# Altium schematic sheet POWER.SchDoc
size A4; SheetNumber: 2; SheetTotal: 6
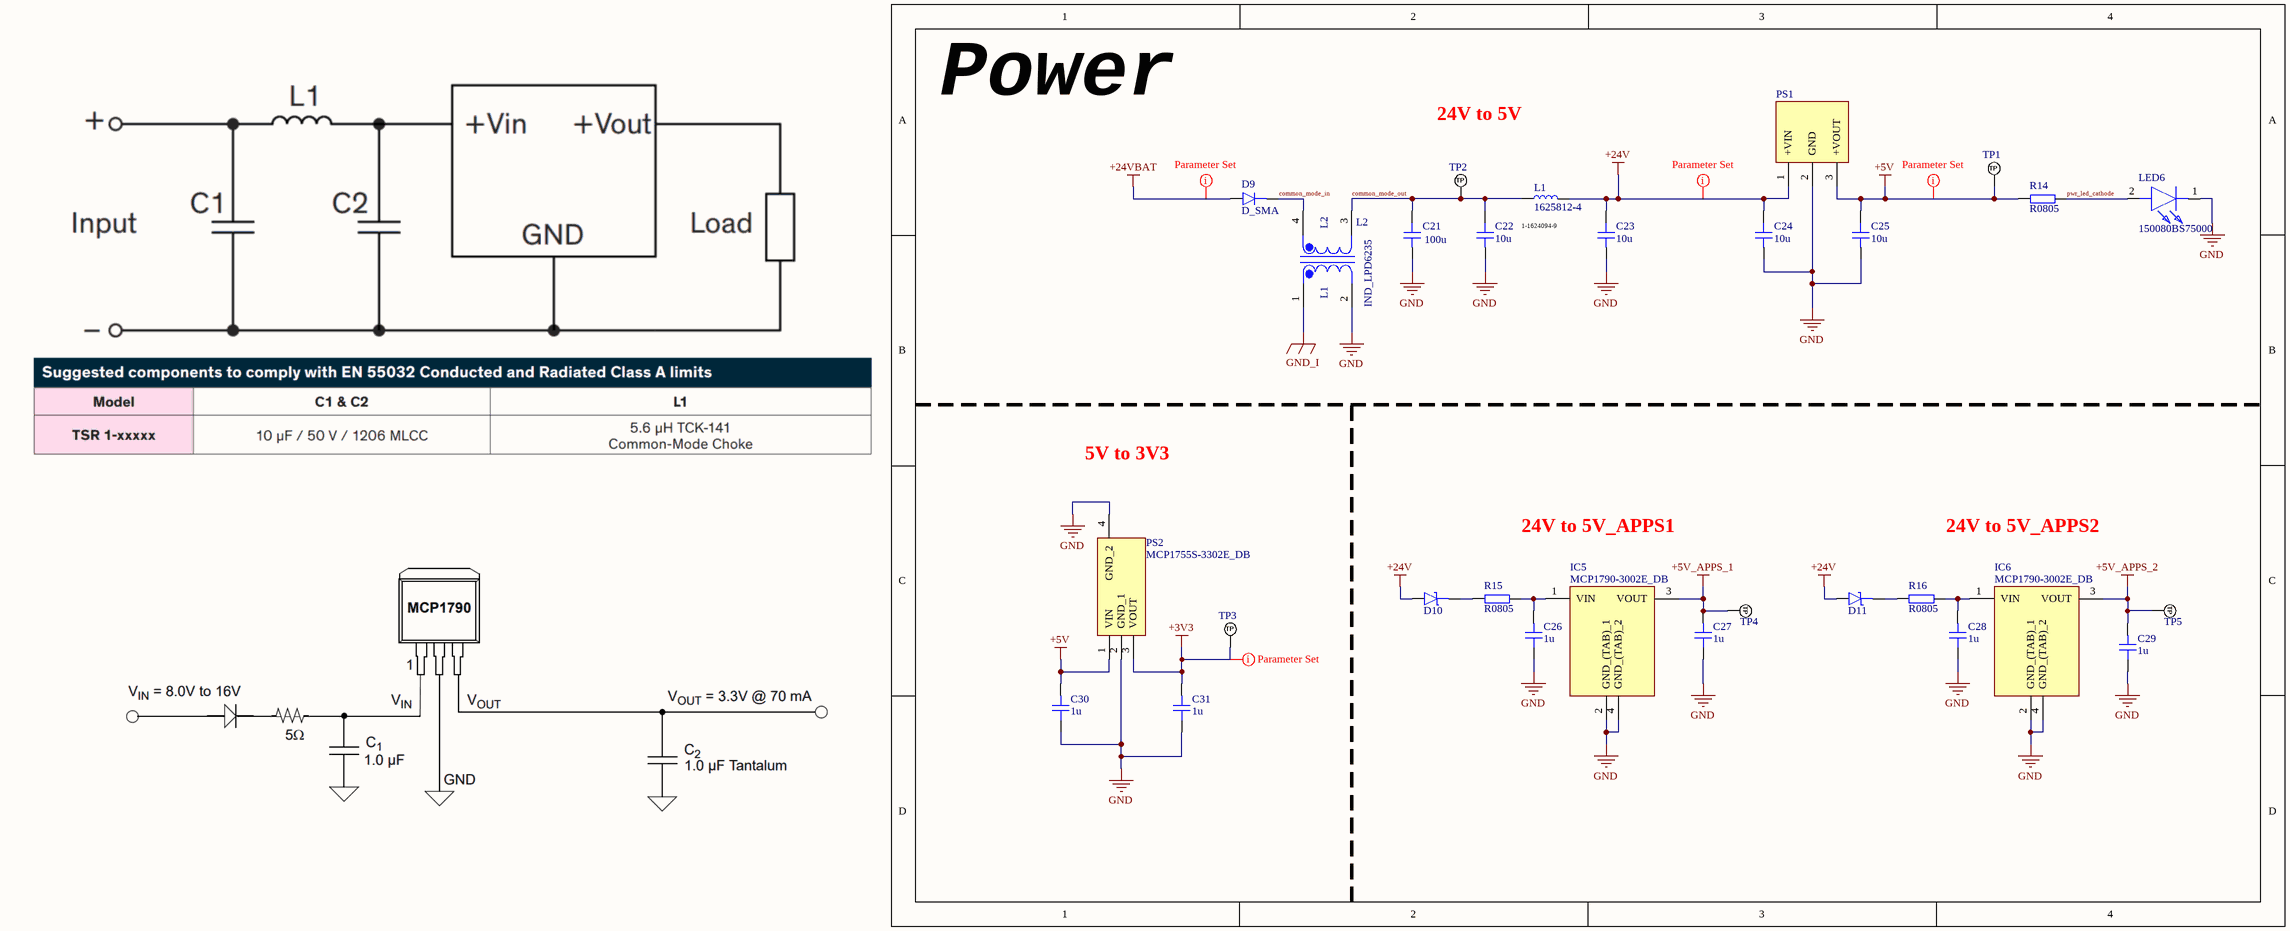
[diagram p0: POWER.SchDoc]

## Parts
C21  100u  [CAP_0805]
C22  10u  [CAP_0805]
C23  10u  [CAP_0805]
C24  10u  [CAP_0805]
C25  10u  [CAP_0805]
C26  1u  [CAP_0805]
C27  1u  [CAP_0805]
C28  1u  [CAP_0805]
C29  1u  [CAP_0805]
C30  1u  [CAP_0805]
C31  1u  [CAP_0805]
D9  D_SMA  [DO-214AC-2 (SMA)]
D10  D_SCHOTTKY_SOD_323  [SOD-323]  (value not drawn)
D11  D_SCHOTTKY_SOD_323  [SOD-323]  (value not drawn)
IC5  MCP1790-3002E_DB  [SOT230P700X180-4N]
IC6  MCP1790-3002E_DB  [SOT230P700X180-4N]
L1  1625812-4  [147873-2 smd button]
L2  IND_LPD6235  [IND_LPD6235]
LED6  150080BS75000  [LEDC2012X80N]
PS1  R-78E5.0-0.5  [R78E5005]  (value not drawn)
PS2  MCP1755S-3302E_DB  [SOT230P700X180-4N]
R14  R0805  [RES_0805]
R15  R0805  [RES_0805]
R16  R0805  [RES_0805]
TP1  TP_NOBOM  [PAD_RND_1MM]  (value not drawn)  (no BOM)
TP2  TP_NOBOM  [PAD_RND_1MM]  (value not drawn)  (no BOM)
TP3  TP_NOBOM  [PAD_RND_1MM]  (value not drawn)  (no BOM)
TP4  TP_NOBOM  [PAD_RND_1MM]  (value not drawn)  (no BOM)
TP5  TP_NOBOM  [PAD_RND_1MM]  (value not drawn)  (no BOM)

## Nets
+3V3: C31.1 PS2.3(VOUT) TP3.1(TP)
+5V: C25.2 C30.1 PS1.3(+VOUT) PS2.1(VIN) R14.1 TP1.1(TP)
+5V_APPS_1: C27.1 IC5.3(VOUT) TP4.1(TP)
+5V_APPS_2: C29.1 IC6.3(VOUT) TP5.1(TP)
+24V: C23.2 C24.2 D10.A D11.A L1.2 PS1.1(+VIN)
+24VBAT: D9.A
GND: C21.1 C22.1 C23.1 C24.1 C25.1 C26.2 C27.2 C28.2 C29.2 C30.2 C31.2 IC5.2(GND_(TAB)_1) IC5.4(GND_(TAB)_2) IC6.2(GND_(TAB)_1) IC6.4(GND_(TAB)_2) L2.2 LED6.1(K) PS1.2(GND) PS2.2(GND_1) PS2.4(GND_2)
GND_I: L2.1
common_mode_in: D9.K L2.4
common_mode_out: C21.2 C22.2 L1.1 L2.3 TP2.1(TP)
pwr_led_cathode: LED6.2(A) R14.2
NetC26_1: C26.1 IC5.1(VIN) R15.1
NetC28_1: C28.1 IC6.1(VIN) R16.1
NetD10_K: D10.K R15.2
NetD11_K: D11.K R16.2

## Layout directives
net class POWER: +3V3, +5V, +24V, +24VBAT

## Notes on the sheet
- Power
- 24V to 5V
- 1-1624094-9
- 5V to 3V3
- 24V to 5V_APPS1
- 24V to 5V_APPS2
- (in symbol IND_LPD6235) L1

## Library data of the parts
C21-C31 = CAP_0805_10V: Capacitor SMD 0805 10V
D9 = D_SMA: Diode SMD SMA (DO-214AA)
D10 D11 = D_SCHOTTKY_SOD_323: Diode Schottky SMD SOD-323
IC5 IC6 = MCP1790-3002E_DB: Integrated Circuit; Manufacturer_Name: Microchip; Manufacturer_Part_Number: MCP1790-3002E/DB; Datasheet Link: http://ww1.microchip.com/downloads/en/DeviceDoc/22075b.pdf; Height: 1.8mm; Mouser Part Number: 579-MCP1790-3002E/DB; Mouser Price/Stock: https://www.mouser.co.uk/ProductDetail/Microchip-Technology/MCP1790-3002E-DB?qs=gsqZ4L1luKroJ%252BBibcYbpw%3D%3D; Arrow Part Number: MCP1790-3002E/DB; Arrow Price/Stock: https://www.arrow.com/en/products/mcp1790-3002edb/microchip-technology?region=nac
L1 = Power_Inductor: TE 1625812-4
LED6 = 150080BS75000: LED; Manufacturer_Name: Wurth Elektronik; Datasheet Link: https://katalog.we-online.com/led/datasheet/150080BS75000.pdf; Height: 0.8mm; Manufacturer_Part_Number: 150080BS75000; Mouser Part Number: 710-150080BS75000; Mouser Price/Stock: https://www.mouser.co.uk/ProductDetail/Wurth-Elektronik/150080BS75000?qs=2kOmHSv6VfT2tBo3UPVqAQ%3D%3D
PS1 = R-78E5.0-0.5: Power Supply; Manufacturer_Name: RECOM Power; Datasheet Link: https://datasheet.datasheetarchive.com/originals/distributors/Datasheets_SAMA/1560217c2d38d5ce10907af13420fc49.pdf; Height: 10.9mm; Manufacturer_Part_Number: R-78E5.0-0.5; Mouser Part Number: 919-R-78E5.0-0.5; Mouser Price/Stock: https://www.mouser.co.uk/ProductDetail/RECOM-Power/R-78E5.0-0.5?qs=JeAkOuORR2UvBuiB2kZVZQ%3D%3D; Arrow Part Number: R-78E5.0-0.5; Arrow Price/Stock: https://www.arrow.com/en/products/r-78e5.0-0.5/recom-power?region=europe
PS2 = MCP1755S-3302E_DB: Power Supply; Manufacturer_Name: Microchip; Manufacturer_Part_Number: MCP1755S-3302E/DB; Datasheet Link: http://www.farnell.com/datasheets/1697992.pdf; Height: 1.8mm; Mouser Part Number: 579-MCP1755S-3302EDB; Mouser Price/Stock: https://www.mouser.co.uk/ProductDetail/Microchip-Technology/MCP1755S-3302E-DB?qs=OCR3PNzn1cc7Hxpx9CIZgA%3D%3D; Arrow Part Number: MCP1755S-3302E/DB; Arrow Price/Stock: https://www.arrow.com/en/products/mcp1755s-3302edb/microchip-technology?region=nac
R14-R16 = RES_0805: Resistor SMD 0805; Manufacturer: *; Manufacturer Part Number: *; Distributor Link: *; LCSC: *
TP1-TP5 = TEST_POINT_RND_1MM: Test Point Round 1mm (NO BOM)